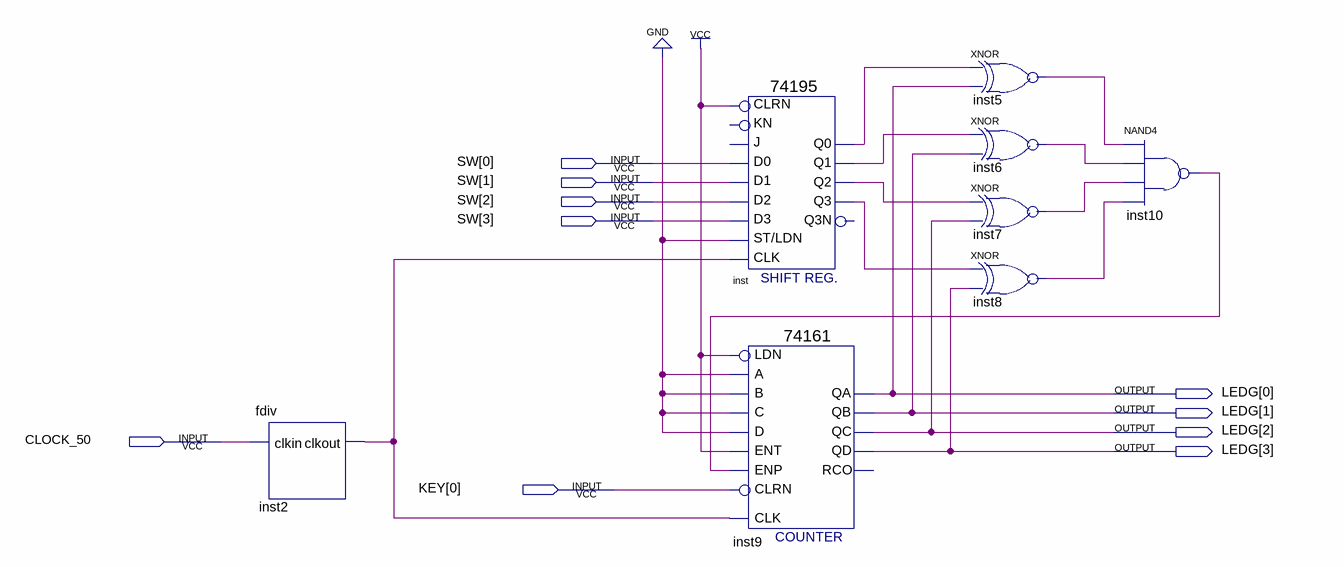
[diagram p0: schematic sheet]
// Quartus schematic Lab12b.bdf as structural Verilog: 8 symbols, 10 pins
module Lab12b (
  input  [3:0] SW,
  input  CLOCK_50,
  input  [0:0] KEY,
  output [3:0] LEDG
);

  wire inst2_clkout, inst5_out, inst6_out, inst7_out, inst8_out, inst10_out, inst_q0, inst_q1, inst_q2,
       inst_q3;

  fdiv inst2 (.clkin(CLOCK_50), .clkout(inst2_clkout));
  \74195  inst (
    .\ST/LDN (1'b0), .CLRN(1'b1), .D2(SW[2]), .D1(SW[1]), .D0(SW[0]), .CLK(inst2_clkout), .D3(SW[3]),
    .Q3(inst_q3), .Q0(inst_q0), .Q1(inst_q1), .Q2(inst_q2));  // open: KN, J, Q3N
  \74161  inst9 (
    .CLRN(KEY[0]), .CLK(inst2_clkout), .ENP(inst10_out), .LDN(1'b1), .A(1'b0), .D(1'b0), .ENT(1'b1),
    .B(1'b0), .C(1'b0), .QD(LEDG[3]), .QC(LEDG[2]), .QB(LEDG[1]), .QA(LEDG[0]));  // open: RCO
  xnor inst5 (inst5_out, inst_q0, LEDG[0]);
  xnor inst6 (inst6_out, inst_q1, LEDG[1]);
  xnor inst7 (inst7_out, inst_q2, LEDG[2]);
  xnor inst8 (inst8_out, inst_q3, LEDG[3]);
  nand inst10 (inst10_out, inst5_out, inst6_out, inst7_out, inst8_out);
endmodule
